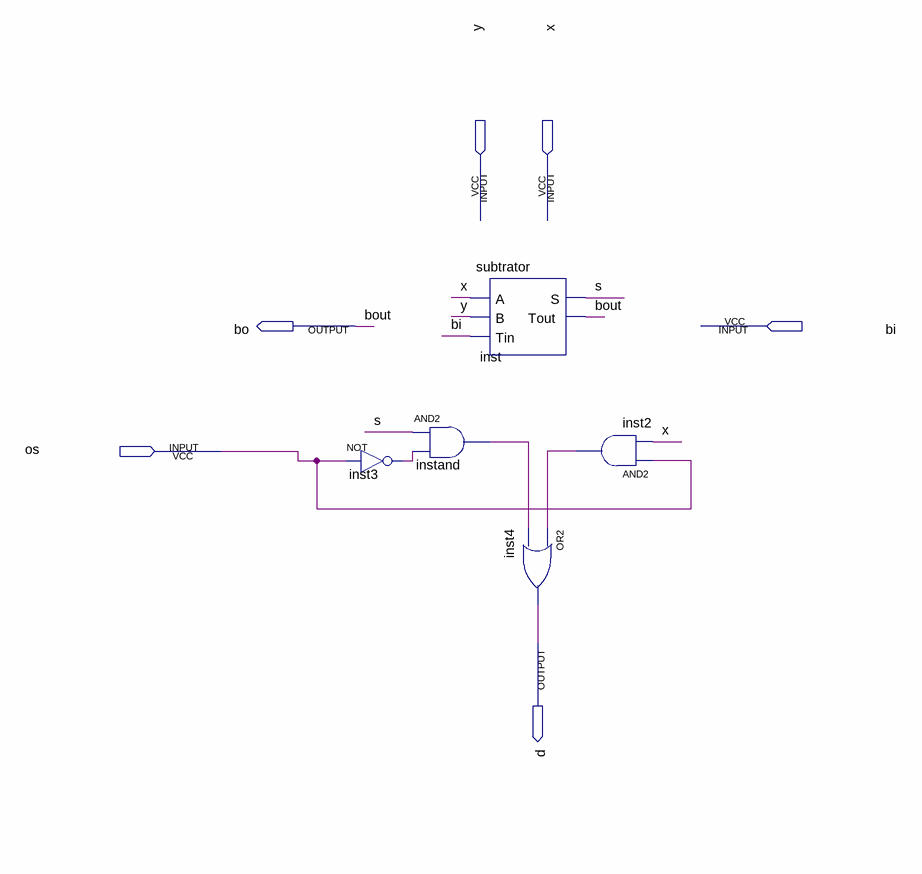
[diagram p0: schematic sheet]
// Quartus schematic csm.bdf as structural Verilog: 5 symbols, 6 pins
module csm (
  input  y,
  input  x,
  input  bi,
  input  os,
  output bo,
  output d
);

  wire inst2_out, inst3_out, instand_out, s;

  not inst3 (inst3_out, os);
  and instand (instand_out, s, inst3_out);
  subtrator inst (.A(x), .B(y), .Tin(bi), .S(s), .Tout(bo));
  or inst4 (d, inst2_out, instand_out);
  and inst2 (inst2_out, os, x);

  // Other names for the same wires on the sheet: bout = bo
endmodule
